# Altium schematic sheet BaseGateDriver.SchDoc
size B
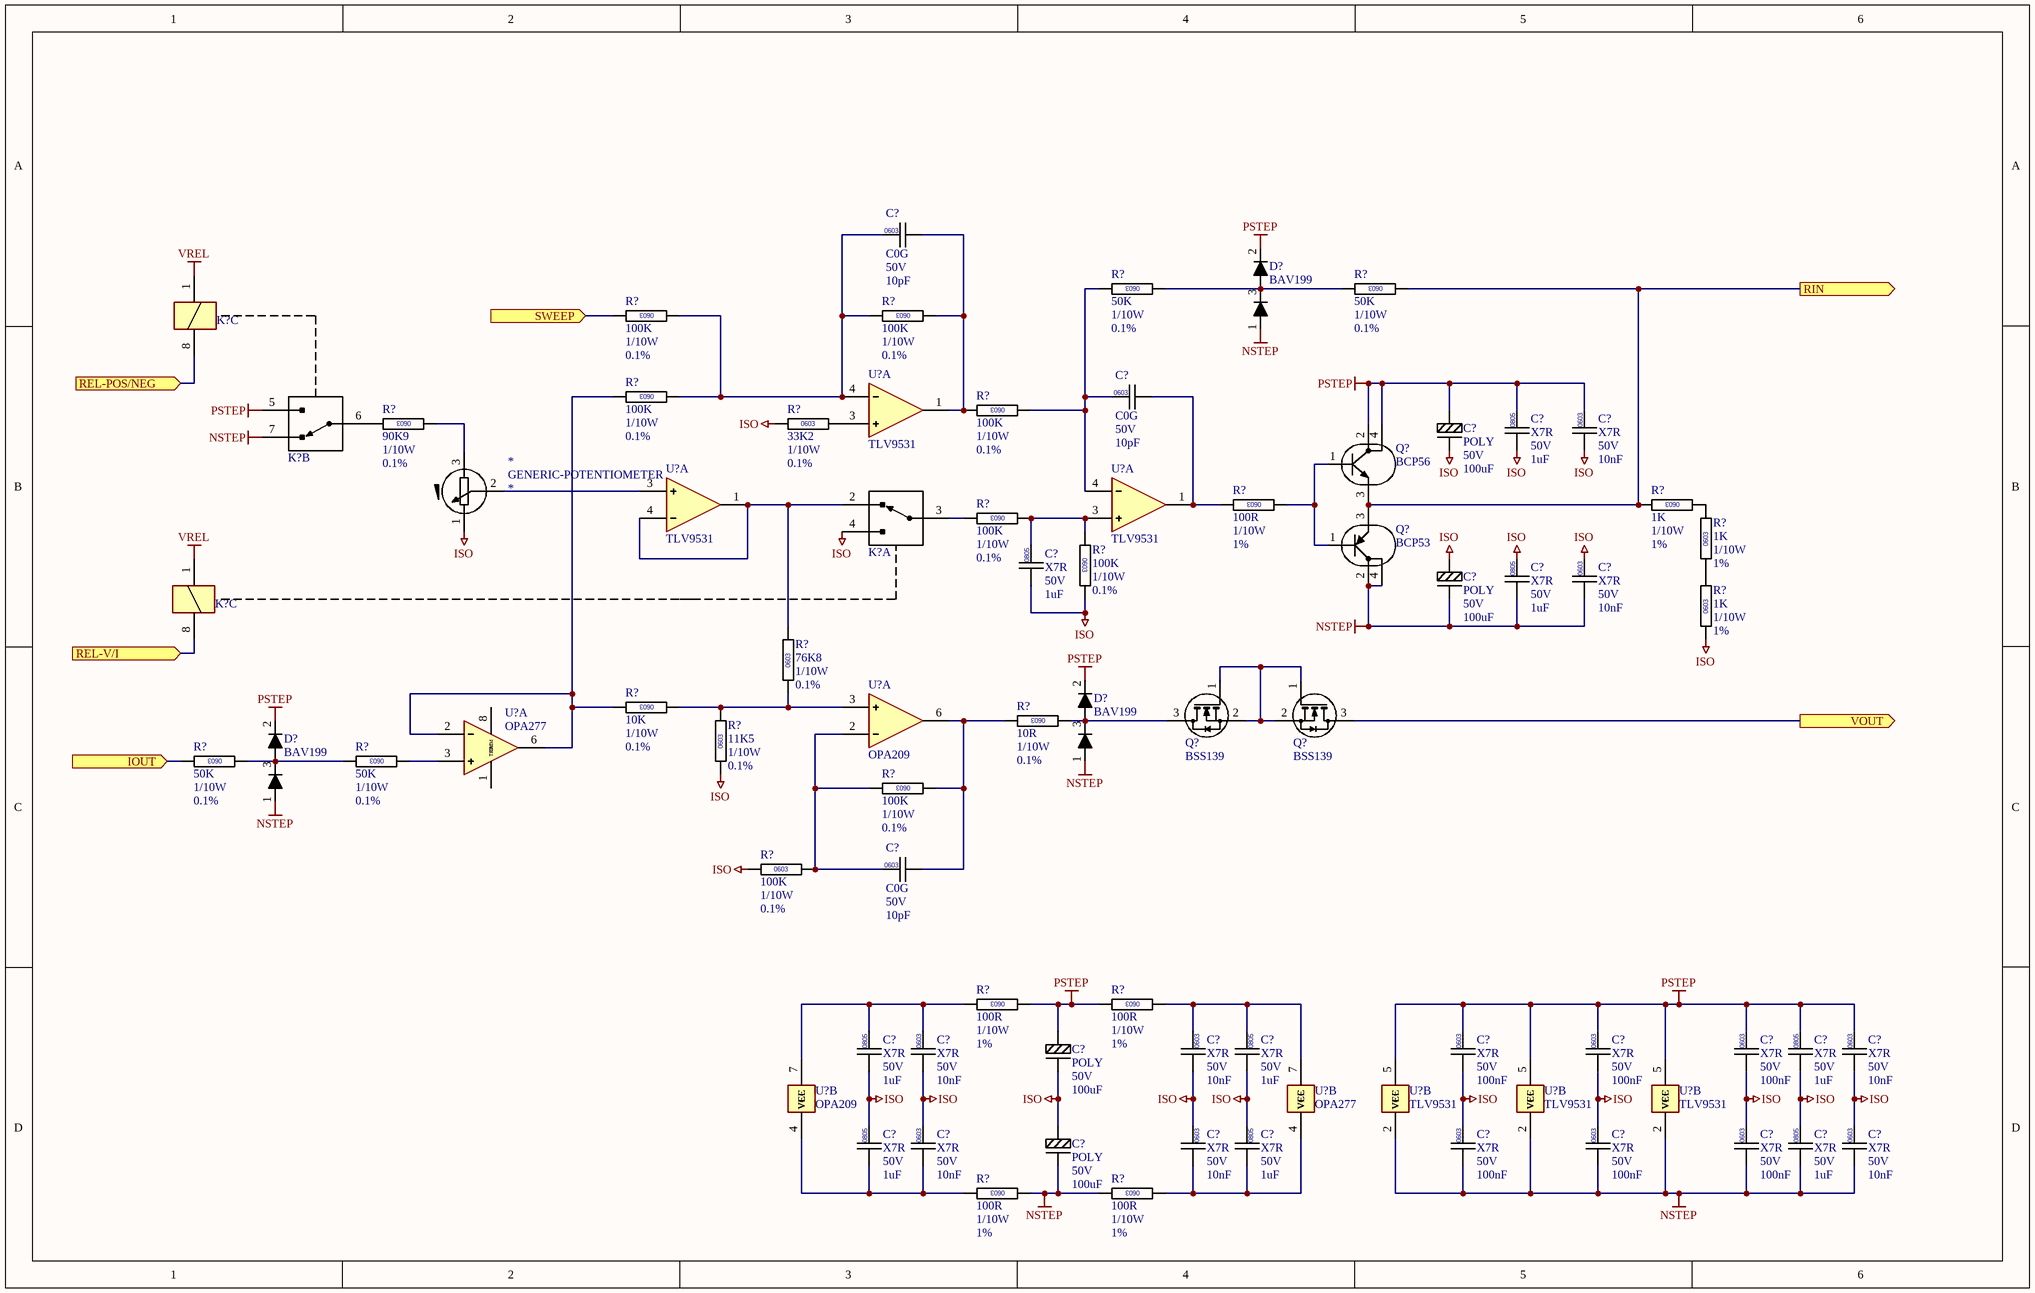
[diagram p0: BaseGateDriver.SchDoc]

## Parts
(Parts that share a designator on the sheet are numbered #1, #2 ... from top to bottom, then left to right.)
*  GENERIC-POTENTIOMETER
C?#1  Dielectric: C0G  Voltage: 50V  Capacitance: 10pF  [CAPC0603]  (hidden comment: CAP0603)
C?#2  Dielectric: C0G  Voltage: 50V  Capacitance: 10pF  [CAPC0603]  (hidden comment: CAP0603)
C?#3  Dielectric: POLY  Voltage: 50V  Capacitance: 100uF  [CAPC0603]  (hidden comment: CAPP)
C?#4  Dielectric: X7R  Voltage: 50V  Capacitance: 1uF  [CAPC0805]  (hidden comment: CAP0805)
C?#5  Dielectric: X7R  Voltage: 50V  Capacitance: 10nF  [CAPC0603]  (hidden comment: CAP0603)
C?#6  Dielectric: X7R  Voltage: 50V  Capacitance: 1uF  [CAPC0805]  (hidden comment: CAP0805)
C?#7  Dielectric: POLY  Voltage: 50V  Capacitance: 100uF  [CAPC0603]  (hidden comment: CAPP)
C?#8  Dielectric: X7R  Voltage: 50V  Capacitance: 1uF  [CAPC0805]  (hidden comment: CAP0805)
C?#9  Dielectric: X7R  Voltage: 50V  Capacitance: 10nF  [CAPC0603]  (hidden comment: CAP0603)
C?#10  Dielectric: C0G  Voltage: 50V  Capacitance: 10pF  [CAPC0603]  (hidden comment: CAP0603)
C?#11  Dielectric: X7R  Voltage: 50V  Capacitance: 1uF  [CAPC0805]  (hidden comment: CAP0805)
C?#12  Dielectric: X7R  Voltage: 50V  Capacitance: 10nF  [CAPC0603]  (hidden comment: CAP0603)
C?#13  Dielectric: POLY  Voltage: 50V  Capacitance: 100uF  [CAPC0603]  (hidden comment: CAPP)
C?#14  Dielectric: X7R  Voltage: 50V  Capacitance: 10nF  [CAPC0603]  (hidden comment: CAP0603)
C?#15  Dielectric: X7R  Voltage: 50V  Capacitance: 1uF  [CAPC0805]  (hidden comment: CAP0805)
C?#16  Dielectric: X7R  Voltage: 50V  Capacitance: 100nF  [CAPC0603]  (hidden comment: CAP0603)
C?#17  Dielectric: X7R  Voltage: 50V  Capacitance: 100nF  [CAPC0603]  (hidden comment: CAP0603)
C?#18  Dielectric: X7R  Voltage: 50V  Capacitance: 100nF  [CAPC0603]  (hidden comment: CAP0603)
C?#19  Dielectric: X7R  Voltage: 50V  Capacitance: 1uF  [CAPC0805]  (hidden comment: CAP0805)
C?#20  Dielectric: X7R  Voltage: 50V  Capacitance: 10nF  [CAPC0603]  (hidden comment: CAP0603)
C?#21  Dielectric: X7R  Voltage: 50V  Capacitance: 1uF  [CAPC0805]  (hidden comment: CAP0805)
C?#22  Dielectric: X7R  Voltage: 50V  Capacitance: 10nF  [CAPC0603]  (hidden comment: CAP0603)
C?#23  Dielectric: POLY  Voltage: 50V  Capacitance: 100uF  [CAPC0603]  (hidden comment: CAPP)
C?#24  Dielectric: X7R  Voltage: 50V  Capacitance: 10nF  [CAPC0603]  (hidden comment: CAP0603)
C?#25  Dielectric: X7R  Voltage: 50V  Capacitance: 1uF  [CAPC0805]  (hidden comment: CAP0805)
C?#26  Dielectric: X7R  Voltage: 50V  Capacitance: 100nF  [CAPC0603]  (hidden comment: CAP0603)
C?#27  Dielectric: X7R  Voltage: 50V  Capacitance: 100nF  [CAPC0603]  (hidden comment: CAP0603)
C?#28  Dielectric: X7R  Voltage: 50V  Capacitance: 100nF  [CAPC0603]  (hidden comment: CAP0603)
C?#29  Dielectric: X7R  Voltage: 50V  Capacitance: 1uF  [CAPC0805]  (hidden comment: CAP0805)
C?#30  Dielectric: X7R  Voltage: 50V  Capacitance: 10nF  [CAPC0603]  (hidden comment: CAP0603)
D?#1  BAV199  [SOD323]
D?#2  BAV199  [SOD323]
D?#3  BAV199  [SOD323]
K?#1  RELA-OMRON-OMRON G6K-2F-Y-TR DC5  (value not drawn)  (part C of 3)
K?#2  RELA-OMRON-OMRON G6K-2F-Y-TR DC5  (value not drawn)  (part B of 3)
K?#3  RELA-OMRON-OMRON G6K-2F-Y-TR DC5  (value not drawn)  (part A of 3)
K?#4  RELA-OMRON-OMRON G6K-2F-Y-TR DC5  (value not drawn)  (part C of 3)
Q?#1  BCP56
Q?#2  BCP53
Q?#3  BSS139
Q?#4  BSS139
R?#1  value 50K  Power: 1/10W  Tolerance: 0.1%  [RESC0603]  (hidden comment: RESC0603)
R?#2  value 50K  Power: 1/10W  Tolerance: 0.1%  [RESC0603]  (hidden comment: RESC0603)
R?#3  value 100K  Power: 1/10W  Tolerance: 0.1%  [RESC0603]  (hidden comment: RESC0603)
R?#4  value 100K  Power: 1/10W  Tolerance: 0.1%  [RESC0603]  (hidden comment: RESC0603)
R?#5  value 100K  Power: 1/10W  Tolerance: 0.1%  [RESC0603]  (hidden comment: RESC0603)
R?#6  value 100K  Power: 1/10W  Tolerance: 0.1%  [RESC0603]  (hidden comment: RESC0603)
R?#7  value 90K9  Power: 1/10W  Tolerance: 0.1%  [RESC0603]  (hidden comment: RESC0603)
R?#8  value 33K2  Power: 1/10W  Tolerance: 0.1%  [RESC0603]  (hidden comment: RESC0603)
R?#9  value 100R  Power: 1/10W  Tolerance: 1%  [RESC0603]  (hidden comment: RESC0603)
R?#10  value 1K  Power: 1/10W  Tolerance: 1%  [RESC0603]  (hidden comment: RESC0603)
R?#11  value 1K  Power: 1/10W  Tolerance: 1%  [RESC0603]  (hidden comment: RESC0603)
R?#12  value 100K  Power: 1/10W  Tolerance: 0.1%  [RESC0603]  (hidden comment: RESC0603)
R?#13  value 1K  Power: 1/10W  Tolerance: 1%  [RESC0603]  (hidden comment: RESC0603)
R?#14  value 100K  Power: 1/10W  Tolerance: 0.1%  [RESC0603]  (hidden comment: RESC0603)
R?#15  value 76K8  Power: 1/10W  Tolerance: 0.1%  [RESC0603]  (hidden comment: RESC0603)
R?#16  value 10K  Power: 1/10W  Tolerance: 0.1%  [RESC0603]  (hidden comment: RESC0603)
R?#17  value 11K5  Power: 1/10W  Tolerance: 0.1%  [RESC0603]  (hidden comment: RESC0603)
R?#18  value 10R  Power: 1/10W  Tolerance: 0.1%  [RESC0603]  (hidden comment: RESC0603)
R?#19  value 50K  Power: 1/10W  Tolerance: 0.1%  [RESC0603]  (hidden comment: RESC0603)
R?#20  value 50K  Power: 1/10W  Tolerance: 0.1%  [RESC0603]  (hidden comment: RESC0603)
R?#21  value 100K  Power: 1/10W  Tolerance: 0.1%  [RESC0603]  (hidden comment: RESC0603)
R?#22  value 100K  Power: 1/10W  Tolerance: 0.1%  [RESC0603]  (hidden comment: RESC0603)
R?#23  value 100R  Power: 1/10W  Tolerance: 1%  [RESC0603]  (hidden comment: RESC0603)
R?#24  value 100R  Power: 1/10W  Tolerance: 1%  [RESC0603]  (hidden comment: RESC0603)
R?#25  value 100R  Power: 1/10W  Tolerance: 1%  [RESC0603]  (hidden comment: RESC0603)
R?#26  value 100R  Power: 1/10W  Tolerance: 1%  [RESC0603]  (hidden comment: RESC0603)
U?#1  TLV9531  (part A of 2)
U?#2  TLV9531  (part A of 2)
U?#3  TLV9531  (part A of 2)
U?#4  OPA209  (part A of 2)
U?#5  OPA277  (part A of 2)
U?#6  OPA209  (part B of 2)
U?#7  OPA277  (part B of 2)
U?#8  TLV9531  (part B of 2)
U?#9  TLV9531  (part B of 2)
U?#10  TLV9531  (part B of 2)

## Ports
IOUT (in), REL-POS/NEG (in), REL-V/I (in), RIN (out), SWEEP (in), VOUT (out)

## Nets
ISO: *.1 C?#3.2 C?#4.2 C?#5.2 C?#6.2 C?#7.1 C?#8.1 C?#9.1 C?#11.2 C?#12.2 C?#13.2 C?#14.2 C?#15.2 C?#16.2 C?#17.2 C?#18.2 C?#19.2 C?#20.2 C?#21.1 C?#22.1 C?#23.1 C?#24.1 C?#25.1 C?#26.1 C?#27.1 C?#28.1 C?#29.1 C?#30.1 K?#3.4(NO) R?#8.2 R?#13.2 R?#14.1 R?#17.2 R?#22.2
NSTEP: C?#7.2 C?#8.2 C?#9.2 C?#23.2 C?#26.2 C?#27.2 C?#28.2 C?#29.2 C?#30.2 D?#1.1(K) D?#2.1(K) D?#3.1(K) K?#2.7(NC) Q?#2.2(C) Q?#2.4(C) R?#25.2 R?#26.1 U?#8.2(VEE) U?#9.2(VEE) U?#10.2(VEE)
PSTEP: C?#3.1 C?#4.1 C?#5.1 C?#13.1 C?#16.1 C?#17.1 C?#18.1 C?#19.1 C?#20.1 D?#1.2(A) D?#2.2(A) D?#3.2(A) K?#2.5(NO) Q?#1.2(C) Q?#1.4(C) R?#23.2 R?#24.1 U?#8.5(VCC) U?#9.5(VCC) U?#10.5(VCC)
VREL: K?#1.1 K?#4.1
IOUT: R?#19.2 ; port IOUT
REL-POS/NEG: K?#1.8 ; port REL-POS/NEG
REL-V/I: K?#4.8 ; port REL-V/I
RIN: Q?#1.3(E) Q?#2.3(E) R?#2.2 R?#10.1 ; port RIN
SWEEP: R?#3.1 ; port SWEEP
VOUT: Q?#4.3(D) ; port VOUT
Net*_2: *.2 U?#2.3(+)
Net*_3: *.3 R?#7.2
NetC?#1_1: C?#1.1 R?#3.2 R?#4.1 R?#5.2 U?#1.4(-)
NetC?#1_2: C?#1.2 R?#4.2 R?#6.1 U?#1.1(O)
NetC?#2_1: C?#2.1 R?#1.1 R?#6.2 U?#3.4(-)
NetC?#2_2: C?#2.2 R?#9.1 U?#3.1(O)
NetC?#6_1: C?#6.1 R?#12.2 R?#14.2 U?#3.3(+)
NetC?#10_1: C?#10.1 R?#21.1 R?#22.1 U?#4.2(-)
NetC?#10_2: C?#10.2 R?#18.1 R?#21.2 U?#4.6(O)
NetC?#11_1: C?#11.1 C?#12.1 R?#23.1 U?#6.7(VCC)
NetC?#14_1: C?#14.1 C?#15.1 R?#24.2 U?#7.7(VCC)
NetC?#21_2: C?#21.2 C?#22.2 R?#25.1 U?#6.4(VEE)
NetC?#24_2: C?#24.2 C?#25.2 R?#26.2 U?#7.4(VEE)
NetD?#1_3: D?#1.3(A) R?#1.2 R?#2.1
NetD?#2_3: D?#2.3(A) Q?#3.3(D) R?#18.2
NetD?#3_3: D?#3.3(A) R?#19.1 R?#20.2
NetK?#2_6: K?#2.6(COM) R?#7.1
NetK?#3_2: K?#3.2(NC) R?#15.1 U?#2.1(O) U?#2.4(-)
NetK?#3_3: K?#3.3(COM) R?#12.1
NetQ?#1_1: Q?#1.1(B) Q?#2.1(B) R?#9.2
NetQ?#3_1: Q?#3.1(G1) Q?#3.2(S) Q?#4.1(G1) Q?#4.2(S)
NetR?#5_1: R?#5.1 R?#16.1 U?#5.2(-) U?#5.6(O)
NetR?#8_1: R?#8.1 U?#1.3(+)
NetR?#10_2: R?#10.2 R?#11.1
NetR?#11_2: R?#11.2 R?#13.1
NetR?#15_2: R?#15.2 R?#16.2 R?#17.1 U?#4.3(+)
NetR?#20_1: R?#20.1 U?#5.3(+)

Not connected (* = marked no-connect by the designer): U?#5 1(TRIM) 8(TRIM)

## Notes on the sheet
- (in symbol CAPC-0805-1uF-50V) 0805
- (in symbol RESC-0603-1K-1%-1/10W) 0603
- (in symbol RESC-0603-10K-0.1%-1/10W) 0603
- (in symbol RESC-0603-10R-0.1%-1/10W) 0603
- (in symbol RESC-0603-11K5-0.1%-1/10W) 0603
- (in symbol RESC-0603-33K2-0.1%-1/10W) 0603
- (in symbol RESC-0603-50K-0.1%-1/10W) 0603
- (in symbol RESC-0603-76K8-0.1%-1/10W) 0603
- (in symbol RESC-0603-90K9-0.1%-1/10W) 0603
- (in symbol RESC-0603-100K-0.1%-1/10W) 0603
- (in symbol RESC-0603-100R-1%-1/10W) 0603

## Library data of the parts
C?#1 C?#2 C?#10 = CAPC-0603-10PF-50V-C0G: CAPACITOR,CERAMIC,10pF,50V,C0G,0603; Manufacturer 1: KYOCERA; Manufacturer Part Number 1: C0603C100J5GAC; Package / Case: 0603; Location: *; MOUSER: 80-C0603C100J5GAC
C?#3 C?#7 C?#13 C?#23 = CAPP-0603-100uF-50V-POLY: CAPACITOR,POLYMER,100uF,50V,100X102; Manufacturer 1: PANASONIC; Manufacturer Part Number 1: EEHZC1H101P; Package / Case: CAPP100D102H; Location: *; LCSC: C161937
C?#4 C?#6 C?#8 C?#11 C?#15 C?#19 C?#21 C?#25 C?#29 = CAPC-0805-1uF-50V: CAPACITOR,CERAMIC,1uF,50V,X7R,0805; Package / Case: 0805 (2012 metric); Location: *
C?#5 C?#9 C?#12 C?#14 C?#20 C?#22 C?#24 C?#30 = CAPC-0603-10nF-50V-X7R: CAPACITOR,CERAMIC,10nF,50V,X7R,0603; Package / Case: 0603; Location: *
C?#16-C?#18 C?#26-C?#28 = CAPC-0603-100nF-50V-X7R: CAPACITOR,CERAMIC,100nF,50V,X7R,0603; Manufacturer 1: KEMET; Manufacturer Part Number 1: C0603C104K5RACTU; Package / Case: 0603; Location: *; Supplier 1: Mouser; Supplier Part Number 1: 80-C0603C104K5R7867; Supplier 2: Mouser; Supplier Part Number 2: 80-C0603C104K5R7411; Supplier 3: Avnet; Supplier Part Number 3: KGM15BR71H104KT; Supplier 4: Digikey; Supplier Part Number 4: 1276-1000-1-ND; LCSC: C127833; MOUSER: 80-C0603C104K5R
D?#1-D?#3 = DIODE-DIODES-BAV199: DIODE,75V,215mA,SOT23,LOW LEAKAGE; Supplier 1: Arrow Electronics; Supplier Part Number 1: BAV116WS-7
Q?#1 = XSTR-NPN-BCP56
Q?#2 = XSTR-PNP-BCP53
Q?#3 Q?#4 = XSTR-BSS139: XSTR,NMOS,BSS139,SOT23; Vds: 60V; Idmax: 0.3A; Package: SOT23
R?#1 R?#2 R?#19 R?#20 = RESC-0603-50K-0.1%-1/10W: RESISTOR,50K,0.50K1%,100mW,0603 (1608); Location: *
R?#3-R?#6 R?#12 R?#14 R?#21 R?#22 = RESC-0603-100K-0.1%-1/10W: RESISTOR,100K,0.1%,100mW,0603 (1608); Location: *
R?#7 = RESC-0603-90K9-0.1%-1/10W: RESISTOR,90K9,0.1%,100mW,0603 (1608); Location: *
R?#8 = RESC-0603-33K2-0.1%-1/10W: RESISTOR,33K2,0.1%,100mW,0603 (1608); Location: *
R?#9 R?#23-R?#26 = RESC-0603-100R-1%-1/10W: RESISTOR,100R,1%,100mW,0603 (1608); Location: *; LCSC: C105588; Supplier 1: Digikey; Supplier Part Number 1: 311-100HRCT-ND
R?#10 R?#11 R?#13 = RESC-0603-1K-1%-1/10W: RESISTOR,1K,1%,100mW,0603 (1608); Manufacturer 1: YAGEO; Manufacturer Part Number 1: RC0603FR-071KL; Location: *; LCSC: C22548; MOUSER: 603-RC0603FR-071KL
R?#15 = RESC-0603-76K8-0.1%-1/10W: RESISTOR,76K8,0.1%,100mW,0603 (1608); Location: *
R?#16 = RESC-0603-10K-0.1%-1/10W: RESISTOR,10K,0.1%,100mW,0603 (1608); Location: *
R?#17 = RESC-0603-11K5-0.1%-1/10W: RESISTOR,11K5,0.1%,100mW,0603 (1608); Location: *
R?#18 = RESC-0603-10R-0.1%-1/10W: RESISTOR,10R,0.1%,100mW,0603 (1608); Location: *
U?#1-U?#3 U?#8-U?#10 = IC-TI-TLV9531DBV-S
U?#4 U?#6 = IC-TI-OPA209-SO8
U?#5 U?#7 = IC-TI-OPA277
* = GENERIC-POTENTIOMETER: Value: *